# EasyEDA Pro project RC Transmitter.epro

# Schematic V1
Board Name: Transmitter; Create Date: 2025-02-19; Page Name: P1; Project Name: RC Transmitter; Schematic Name: V1; Update Date: 2025-03-01; Company: MUS; Page Size: A4; Version: V1.0
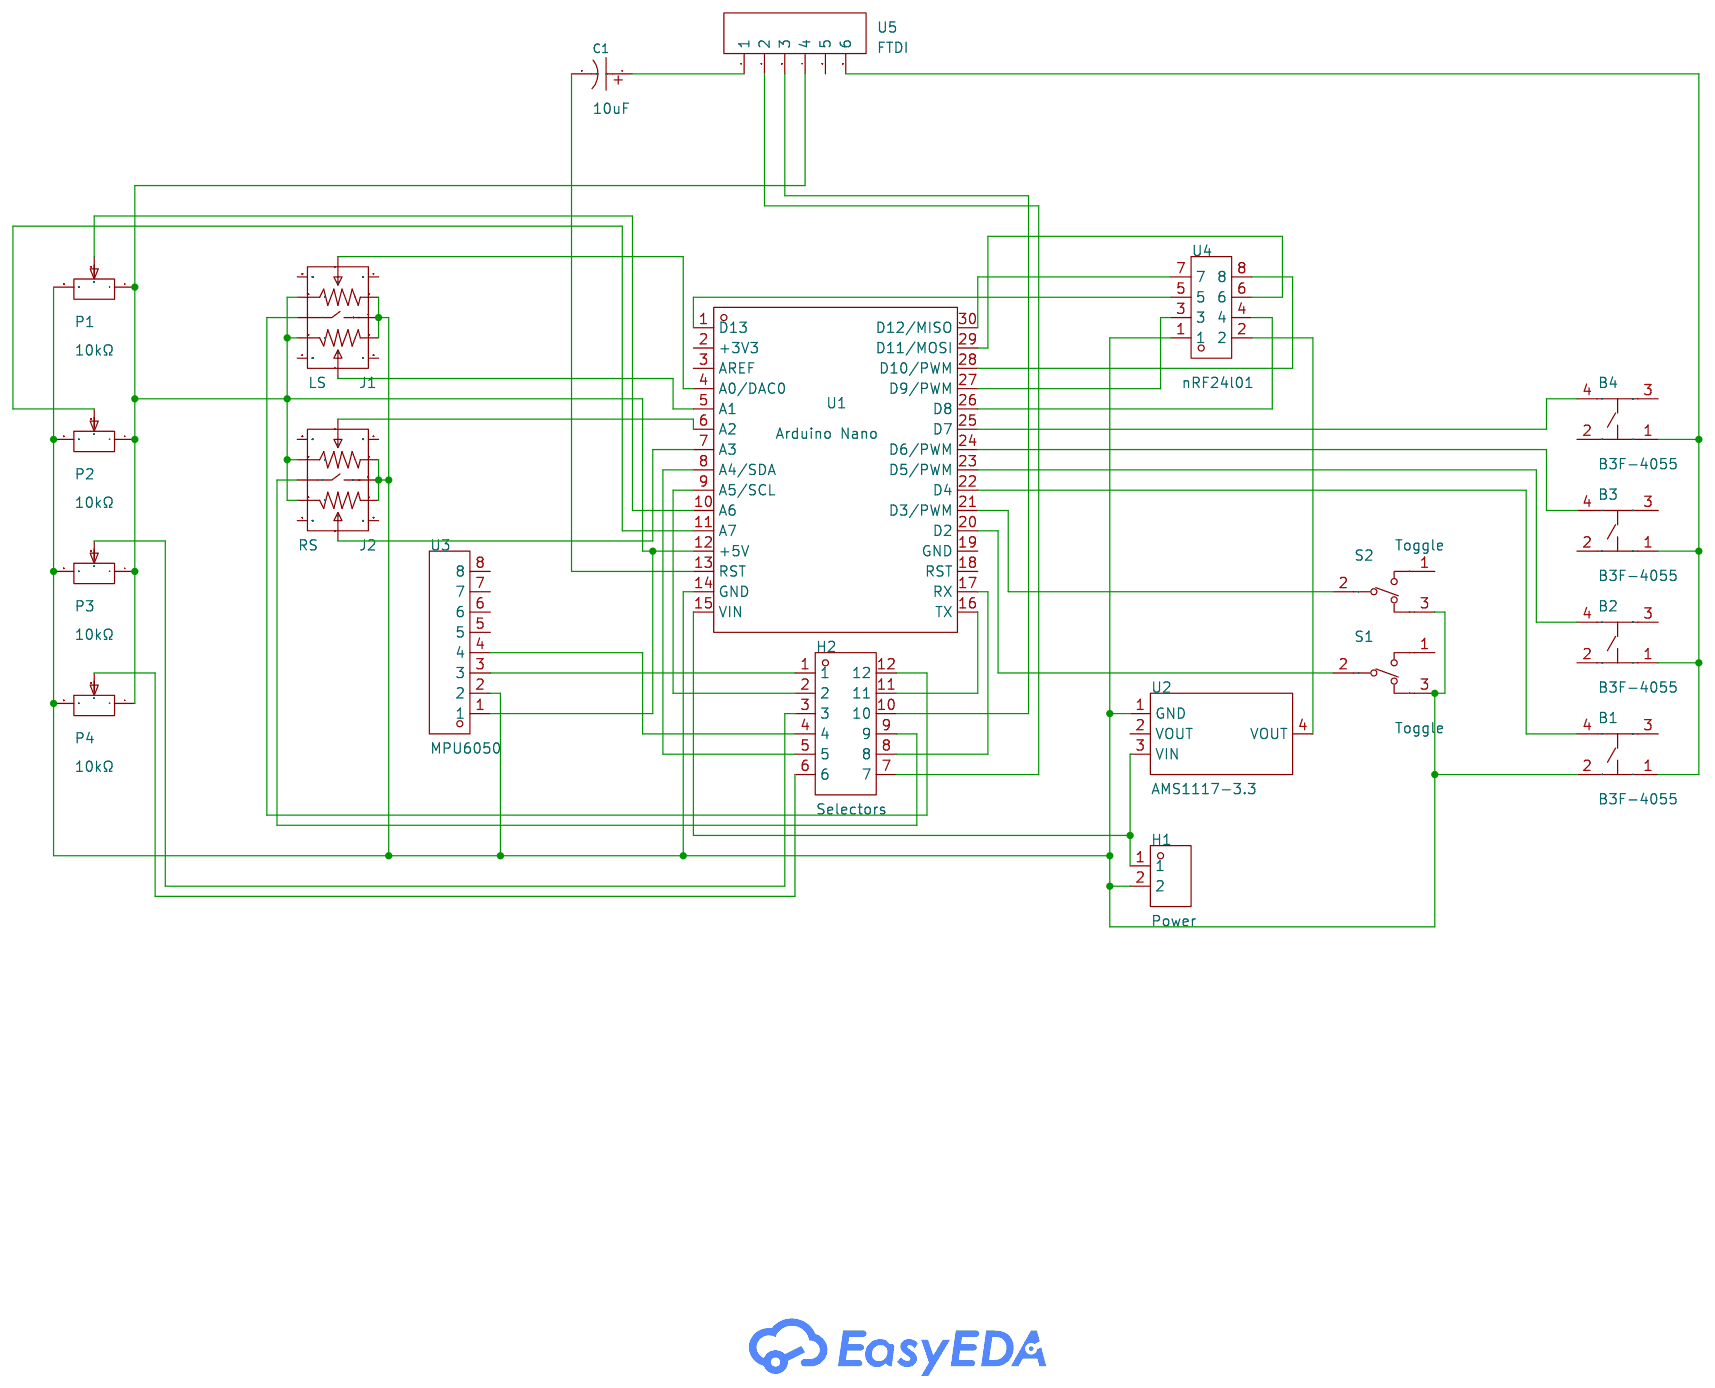
[diagram p0: schematic sheet]

## Parts
B1  B3F-4055  [KEY-TH_4P-L12.0-W12.0-P5.00-LS13.4-EH]
B2  B3F-4055  [KEY-TH_4P-L12.0-W12.0-P5.00-LS13.4-EH]
B3  B3F-4055  [KEY-TH_4P-L12.0-W12.0-P5.00-LS13.4-EH]
B4  B3F-4055  [KEY-TH_4P-L12.0-W12.0-P5.00-LS13.4-EH]
C1  10uF  [CAP-TH_BD5.0-P2.00-D0.8-FD]
H1  Power  [HDR-TH_2P-P2.54-V-M_5]
H2  Selectors  [HDR-TH_12P-P2.54-V-M-R3-C4-S2.54]
J1  LS  [JOYTICK-TH_YF16S-FL7.2-B5KB-45-10-Y_1]
J2  RS  [JOYTICK-TH_YF16S-FL7.2-B5KB-45-10-Y_1]
P1  10kΩ  [RES-ADJ-TH_RK1631110U1Q]
P2  10kΩ  [RES-ADJ-TH_RK1631110U1Q]
P3  10kΩ  [RES-ADJ-TH_RK1631110U1Q]
P4  10kΩ  [RES-ADJ-TH_RK1631110U1Q]
S1  Toggle  [SW-TH_ST-0-103-A01]
S2  Toggle  [SW-TH_ST-0-103-A01]
U1  Arduino Nano  [MOD-TH_ABX00028]
U2  AMS1117-3.3  [SOT-223-3_L6.5-W3.4-P2.30-LS7.0-BR]
U3  MPU6050  [HDR-TH_8P-P2.54-V-F]
U4  nRF24l01  [HDR-TH_8P-P2.54-V-F-R2-C4-S2.54]
U5  FTDI  [HDR-TH_6P-P2.54-V-M-1]

## Library data of the parts
B1-B4 = B3F-4055_C84931: Circuit:SPST Actuator Style:Rectangle button Mounting Style:Direct Insert Switch Length:12mm Switch Width:12mm Switch Height:7.3mm Contact Current:50mA Voltage Rating (DC):24V With Lamp:- Mechanical Life:-; LCSC Part Name: 12*12*7.3mm 直插 轻触开关; Supplier Part: C84931; Manufacturer: OMRON(欧姆龙); Supplier Footprint: 插件; JLCPCB Part Class: Extended Part; Datasheet: https://atta.szlcsc.com/upload/public/pdf/source/20170810/C93157_1502335414592880008.pdf; Supplier: LCSC; Circuit: SPST; Actuator Style: Rectangle button; Mounting Style: Direct Insert; Switch Length: 12mm; Switch Width: 12mm; Switch Height: 7.3mm; Contact Current: 50mA; Voltage Rating (DC): 24V
C1 = RD1H106M05011PC: Capacitance: Tolerance:±20% Tolerance:±20% Rated Voltage: Ripple Current:- Equivalent Series Resistance(ESR):- Lead Spacing: φD: L: Lifetime @ Temp:1000hrs@105℃; LCSC Part Name: 10uF ±20% 50V; Supplier Part: C160624; Manufacturer: SAMWHA(三和); Supplier Footprint: 插件,D5xL11mm; JLCPCB Part Class: Extended Part; Datasheet: https://atta.szlcsc.com/upload/public/pdf/source/20171212/C160624_15130639695151177990.pdf; Supplier: LCSC; Tolerance: ±20%; Lifetime @ Temp: 1000hrs@105℃
H1 = PZ254-1-02-Z-C: Pin Structure:1x2P Pitch:2.54mm Row Spacing:- Circluar Pins/Square Pins:Circular Pins Mounting Type:Straight Number of Rows:Plugin Number of Pins:2P Current Rating (Max):3A Length of Mating Pin:4.13mm Insulation Height:3mm Length of End Connection Pin:3mm; LCSC Part Name: 1x2P 间距:2.54mm 圆针 直插; Supplier Part: C5156429; Manufacturer: HCTL(华灿天禄); Supplier Footprint: 插件,P=2.54mm; JLCPCB Part Class: Extended Part; Datasheet: https://atta.szlcsc.com/upload/public/pdf/source/20230609/791AB95BE9F63E00E86E05F9E750B3EF.pdf; Supplier: LCSC; Pin Structure: 1x2P; Pitch: 2.54mm; Circluar Pins/Square Pins: Circular Pins; Mounting Type: Straight; Number of Rows: Plugin; Number of Pins: 2P; Current Rating (Max): 3A; Length of Mating Pin: 4.13mm; Insulation Height: 3mm; Length of End Connection Pin: 3mm; Contact Plating: Gold; Operating Temperature Range: -40℃~+105℃; Soldering Temperature(Max): 260℃@10S; Color: Black
H2 = HX PZ2.54-3x4P ZZ: Pin Structure:3x4P Pitch:2.54mm Row Spacing:2.54mm Circluar Pins/Square Pins:Policy Mounting Type:Direct Insert Number of Rows:Triple row Number of Pins:12P Current Rating (Max):3A Voltage Rating (Max):- Length of Mating Pin:6mm Insulation Height:2.5mm Le; LCSC Part Name: 3x4P 间距:2.54mm 方针 直插; Supplier Part: C32713291; Manufacturer: hanxia(韩下); Supplier Footprint: 插件,P=2.54mm; JLCPCB Part Class: Extended Part; Datasheet: https://atta.szlcsc.com/upload/public/pdf/source/20240723/03D5BD78F4265407C742BB8D20821E6B.pdf; Supplier: LCSC; Pin Structure: 3x4P; Pitch: 2.54mm; Row Spacing: 2.54mm; Circluar Pins/Square Pins: Policy; Mounting Type: Direct Insert; Number of Rows: Triple row; Number of Pins: 12P; Current Rating (Max): 3A; Length of Mating Pin: 6mm; Insulation Height: 2.5mm; Length of End Connection Pin: 3mm; Contact Material: Brass; Contact Plating: Gold; Operating Temperature Range: -40℃~+105℃; Color: Black
J1 J2 = YK16S-L7.2-B10Ka(32-8)-G-A29: Supplier Part: C37323746; Manufacturer: YTL(亚特联); Supplier Footprint: 插件-14P,25.5x20.3mm; JLCPCB Part Class: Extended Part; Datasheet: https://atta.szlcsc.com/upload/public/pdf/source/20240806/64164D0292DFB73772BA7D51AE6DE61A.pdf; Supplier: LCSC
P1-P4 = RK1631110U1Q: Resistance: Tolerance:±20% Tolerance:±20% Rated Voltage:5V Power(Watts):100mW Turns:-; LCSC Part Name: 10kΩ ±20%; Supplier Part: C370978; Manufacturer: ALPSALPINE(阿尔卑斯阿尔派); Supplier Footprint: 插件-3P; JLCPCB Part Class: Extended Part; Datasheet: https://atta.szlcsc.com/upload/public/pdf/source/20200316/C370978_CD3B440EA36CD020F36D6A1E0C06FB64.pdf; Supplier: LCSC; Tolerance: ±20%; Rated Voltage: 5V; Power(Watts): 100mW
S1 S2 = ST-0-103-A01-T000-RS: Circuit:Single Pole Double Throw (SPDT) Switch Length:8.3mm Switch Width:5.2mm Switch Height:23.6mm Mechanical Life:- Contact Current:3A Voltage Rating (AC):125V Actuator Type:Cylinder knob Pin Style:Solder Mounting Style:Direct Insert Operating Temperatu; LCSC Part Name: 超小型钮子三脚三档 五件套 含配件; Supplier Part: C1788488; Manufacturer: YUEN FUNG(源丰); Supplier Footprint: 插件; JLCPCB Part Class: Extended Part; Datasheet: https://atta.szlcsc.com/upload/public/pdf/source/20230720/34A1F41796E6F2C5E358D19C4AAA567D.pdf; Supplier: LCSC; Circuit: Single Pole Double Throw (SPDT); Switch Length: 8.3mm; Switch Width: 5.2mm; Switch Height: 23.6mm; Contact Current: 3A; Voltage Rating (AC): 125V; Actuator Type: Cylinder knob; Pin Style: Solder; Mounting Style: Direct Insert; Operating Temperature: -25℃~+85℃
U1 = ABX00028: Supplier Part: C21303176; Manufacturer: arduino; Datasheet: https://atta.szlcsc.com/upload/public/pdf/source/20240516/DBE20BC6A27351D8B1B352A6E0678D57.pdf; Supplier: LCSC
U2 = AMS1117-3.3_C6186: Output Type:Fixed Voltage - Supply:- Output Voltage:3.3V Output Voltage:3.3V Output Current:1A Power Supply Rejection Ratio (PSRR):72dB@(120Hz) Voltage Dropout:1.3V@(800mA) standby current:- Noise:- Features:Overcurrent Protection(OCP)；Thermal Protection(; LCSC Part Name: 输出3.3V 1A; Supplier Part: C6186; Manufacturer: AMS; Supplier Footprint: SOT-223; JLCPCB Part Class: Basic Part; Datasheet: https://atta.szlcsc.com/upload/public/pdf/source/20180727/C6186_7A095716F0823C02F1997A905E26C086.pdf; Supplier: LCSC; Output Type: Fixed; Output Voltage: 3.3V; Output Current: 1A; Power Supply Rejection Ratio (PSRR): 72dB@(120Hz); Voltage Dropout: 1.3V@(800mA); Features: Overcurrent Protection(OCP)；Thermal Protection(TSD); Output Configuration: Positive electrode; Number of Outputs: 1
U3 = KH-2.54FH-1X8P-H8.5: Holes Structure:1x8P Pitch:2.54mm Row Spacing:- Circular Hole / Square Hole:Square Holes Mounting Type:Straight Number of Rows:Plugin Number of Holes:8P Current Rating (Max):3A Voltage Rating (Max):- Holes Direction:Top Insulation Height:8.5mm Operating T; LCSC Part Name: 间距:2.54mm 1x8P 直插; Supplier Part: C2905417; Manufacturer: kinghelm(金航标); Supplier Footprint: 插件,P=2.54mm; JLCPCB Part Class: Extended Part; Datasheet: https://atta.szlcsc.com/upload/public/pdf/source/20211019/4EE60A4A588681C04A5AE3F1D2563204.pdf; Supplier: LCSC; Holes Structure: 1x8P; Pitch: 2.54mm; Circular Hole / Square Hole: Square Holes; Mounting Type: Straight; Number of Rows: Plugin; Number of Holes: 8P; Current Rating (Max): 3A; Holes Direction: Top; Insulation Height: 8.5mm; Operating Temperature Range: -40℃~+105℃
U4 = 2.54-2*4: Holes Structure:2x4P Pitch:2.54mm Row Spacing:2.54mm Circular Hole / Square Hole:Square Holes Mounting Type:Straight Number of Rows:双排 Number of Holes:8P Current Rating (Max):2.5A Voltage Rating (Max):- Holes Direction:Top Insulation Height:8.5mm Operatin; LCSC Part Name: 间距:2.54mm 2x4P 直插; Supplier Part: C2977588; Manufacturer: ZHOURI(洲日); Supplier Footprint: 插件,P=2.54mm; JLCPCB Part Class: Extended Part; Datasheet: https://atta.szlcsc.com/upload/public/pdf/source/20220328/363EB391BC0EB759CF231FC910753CBE.pdf; Supplier: LCSC; Holes Structure: 2x4P; Pitch: 2.54mm; Row Spacing: 2.54mm; Circular Hole / Square Hole: Square Holes; Mounting Type: Straight; Number of Rows: 双排; Number of Holes: 8P; Current Rating (Max): 2.5A; Holes Direction: Top; Insulation Height: 8.5mm; Operating Temperature Range: -40℃~+105℃
U5 = 2.54-1x6P直针: Pin Structure:1x6P Pitch:2.54mm Row Spacing:- Circluar Pins/Square Pins:Square Pins Mounting Type:Straight Number of Rows:Plugin Number of Pins:6P Current Rating (Max):3A Voltage Rating (Max):- Length of Mating Pin:- Insulation Height:- Contact Material:; LCSC Part Name: 间距:2.54mm 1x6P 直插 方针; Supplier Part: C37208; Manufacturer: BOOMELE(博穆精密); Supplier Footprint: 插件,P=2.54mm; JLCPCB Part Class: Extended Part; Supplier: LCSC; Pin Structure: 1x6P; Pitch: 2.54mm; Circluar Pins/Square Pins: Square Pins; Mounting Type: Straight; Number of Rows: Plugin; Number of Pins: 6P; Current Rating (Max): 3A; Operating Temperature Range: -40℃~+105℃; Color: Black

## Nets
$1N1147: H1.1 U1.15(VIN) U2.3(VIN)
$1N1199: U2.4(VOUT) U4.2
$1N1205: U1.26(D8) U4.4
$1N1524: H2.11 U1.16(TX)
$1N1529: H2.8 U1.17(RX)
$1N1536: H2.2 U1.9(A5/SCL)
$1N1543: H2.5 U1.8(A4/SDA)
$1N1578: H2.1 U3.3
$1N1583: H2.4 U3.4
$1N2005: J1.3 J1.6 J2.3 J2.6 P1.1 P2.1 P3.1 P4.1 U1.12(+5V) U3.1 U5.4
$1N2037: J1.2 U1.4(A0/DAC0)
$1N2043: J1.5 U1.5(A1)
$1N2050: J2.2 U1.6(A2)
$1N2056: J2.5 U1.7(A3)
$1N2070: H2.9 J2.7
$1N2078: H2.12 J1.7
$1N2449: S1.2 U1.20(D2)
$1N2457: S2.2 U1.21(D3/PWM)
$1N2530: B1.2 H1.2 J1.1 J1.4 J1.8 J2.1 J2.4 J2.8 P1.3 P2.3 P3.3 P4.3 S1.3 S2.3 U1.14(GND) U2.1(GND) U3.2 U4.1
$1N3701: P1.2 U1.10(A6)
$1N3709: P2.2 U1.11(A7)
$1N3721: H2.6 P4.2
$1N3728: H2.3 P3.2
$1N3737: B1.1 B2.1 B3.1 B4.1 U5.6
$1N3876: U1.1(D13) U4.5
$1N3899: U1.27(D9/PWM) U4.3
$1N3905: U1.30(D12/MISO) U4.7
$1N3910: U1.29(D11/MOSI) U4.6
$1N3918: U1.28(D10/PWM) U4.8
$1N3925: B4.4 U1.25(D7)
$1N3931: B3.4 U1.24(D6/PWM)
$1N3938: B2.4 U1.23(D5/PWM)
$1N3945: B1.4 U1.22(D4)
$1N4184: C1.1 U5.1
$1N4188: C1.2 U1.13(RST)
$1N4194: H2.10 U5.3
$1N4204: H2.7 U5.2

Not connected (* = marked no-connect by the designer): B1 3; B2 2 3; B3 2 3; B4 2 3; J1 9(shell) 10(shell) 11(shell) 12(shell); J2 9(shell) 10(shell) 11(shell) 12(shell); S1 1; S2 1; U1 2(+3V3) 3(AREF) 18(RST) 19(GND); U2 2(VOUT); U3 5 6 7 8; U5 5

# Board PCB
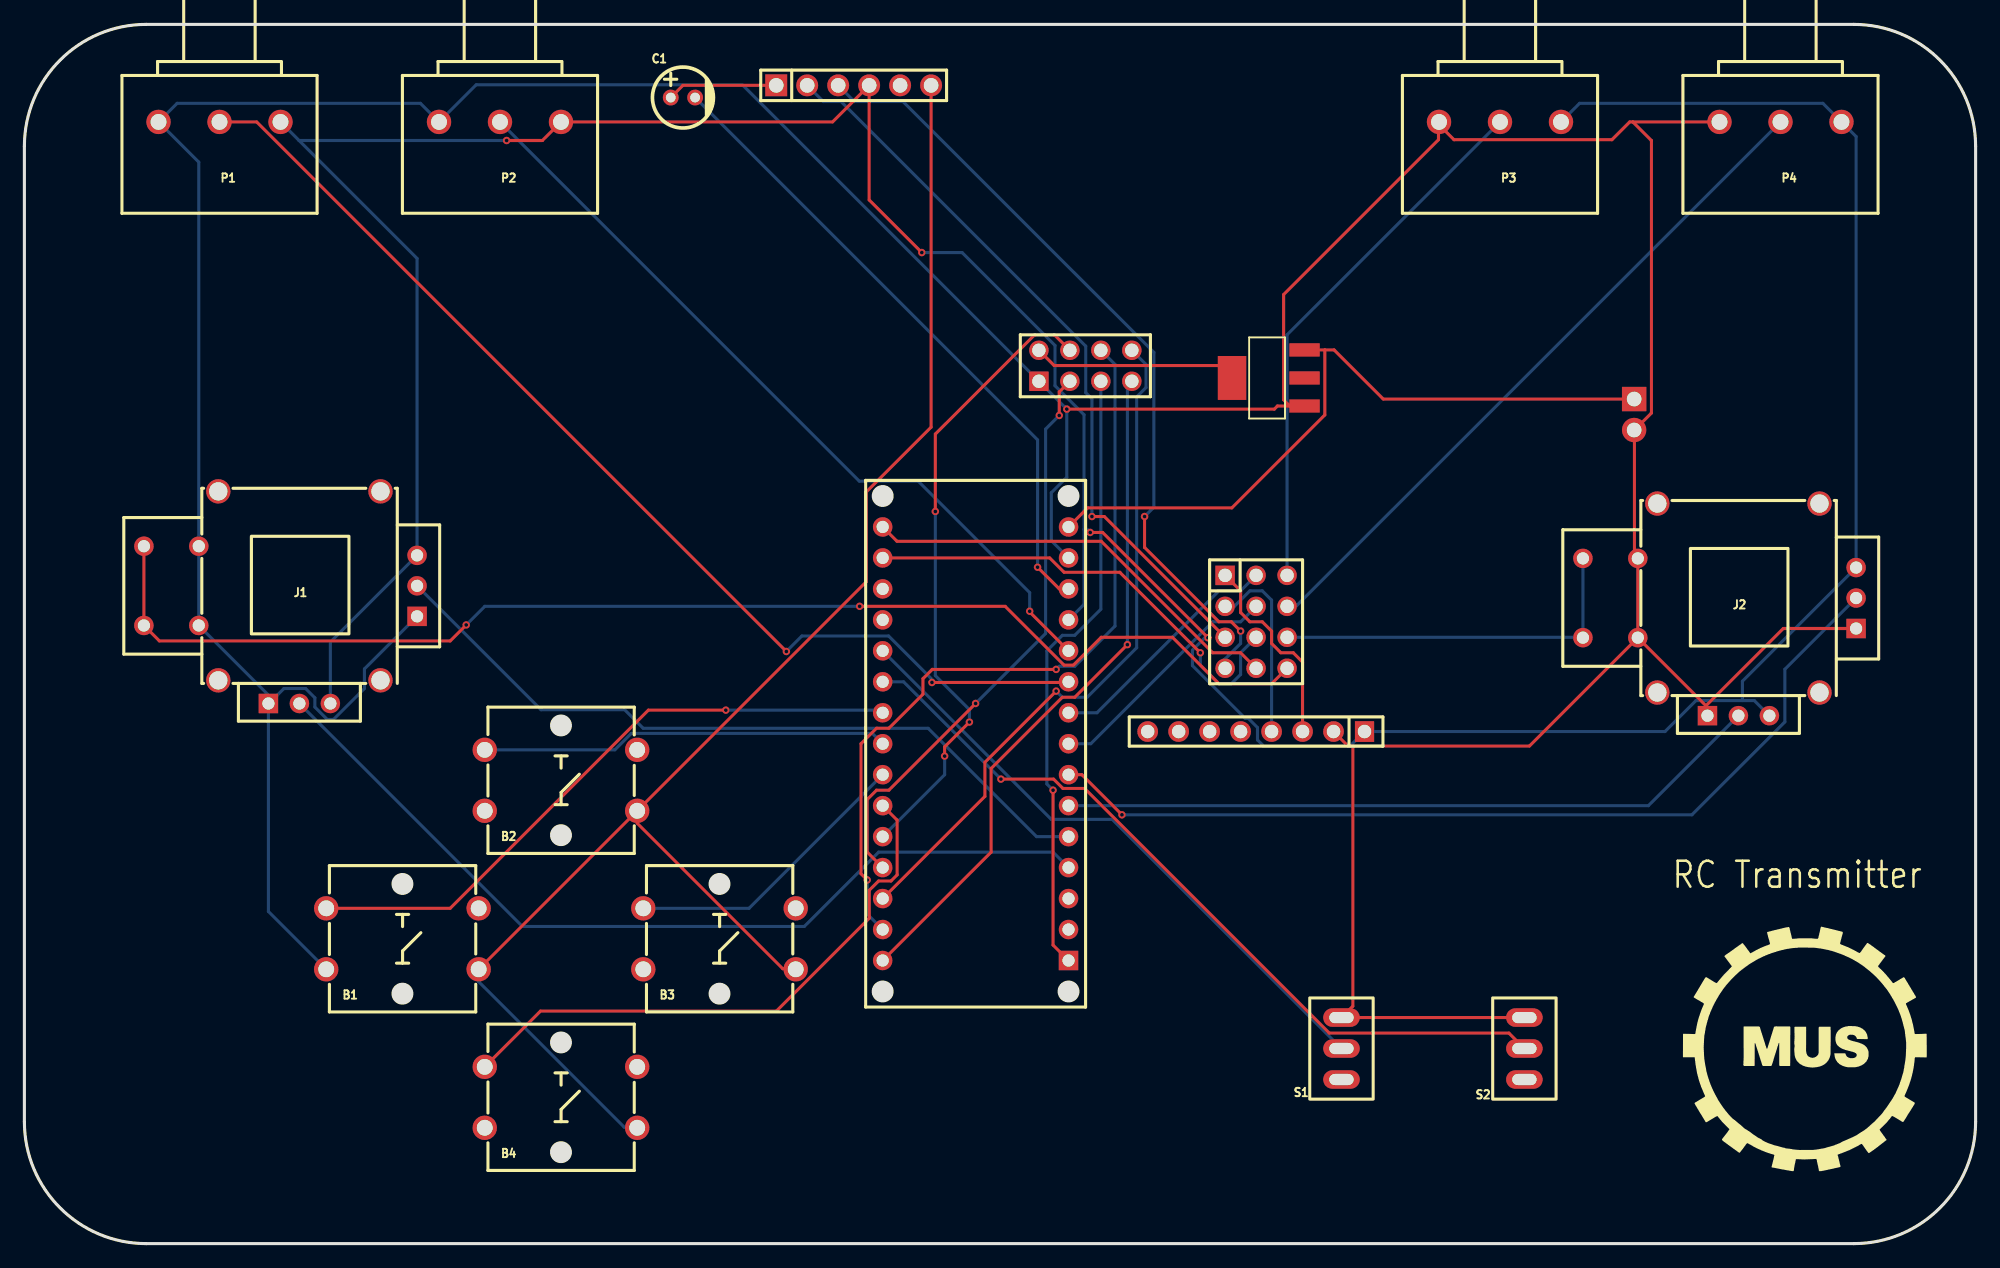
[diagram p1: board, top side]
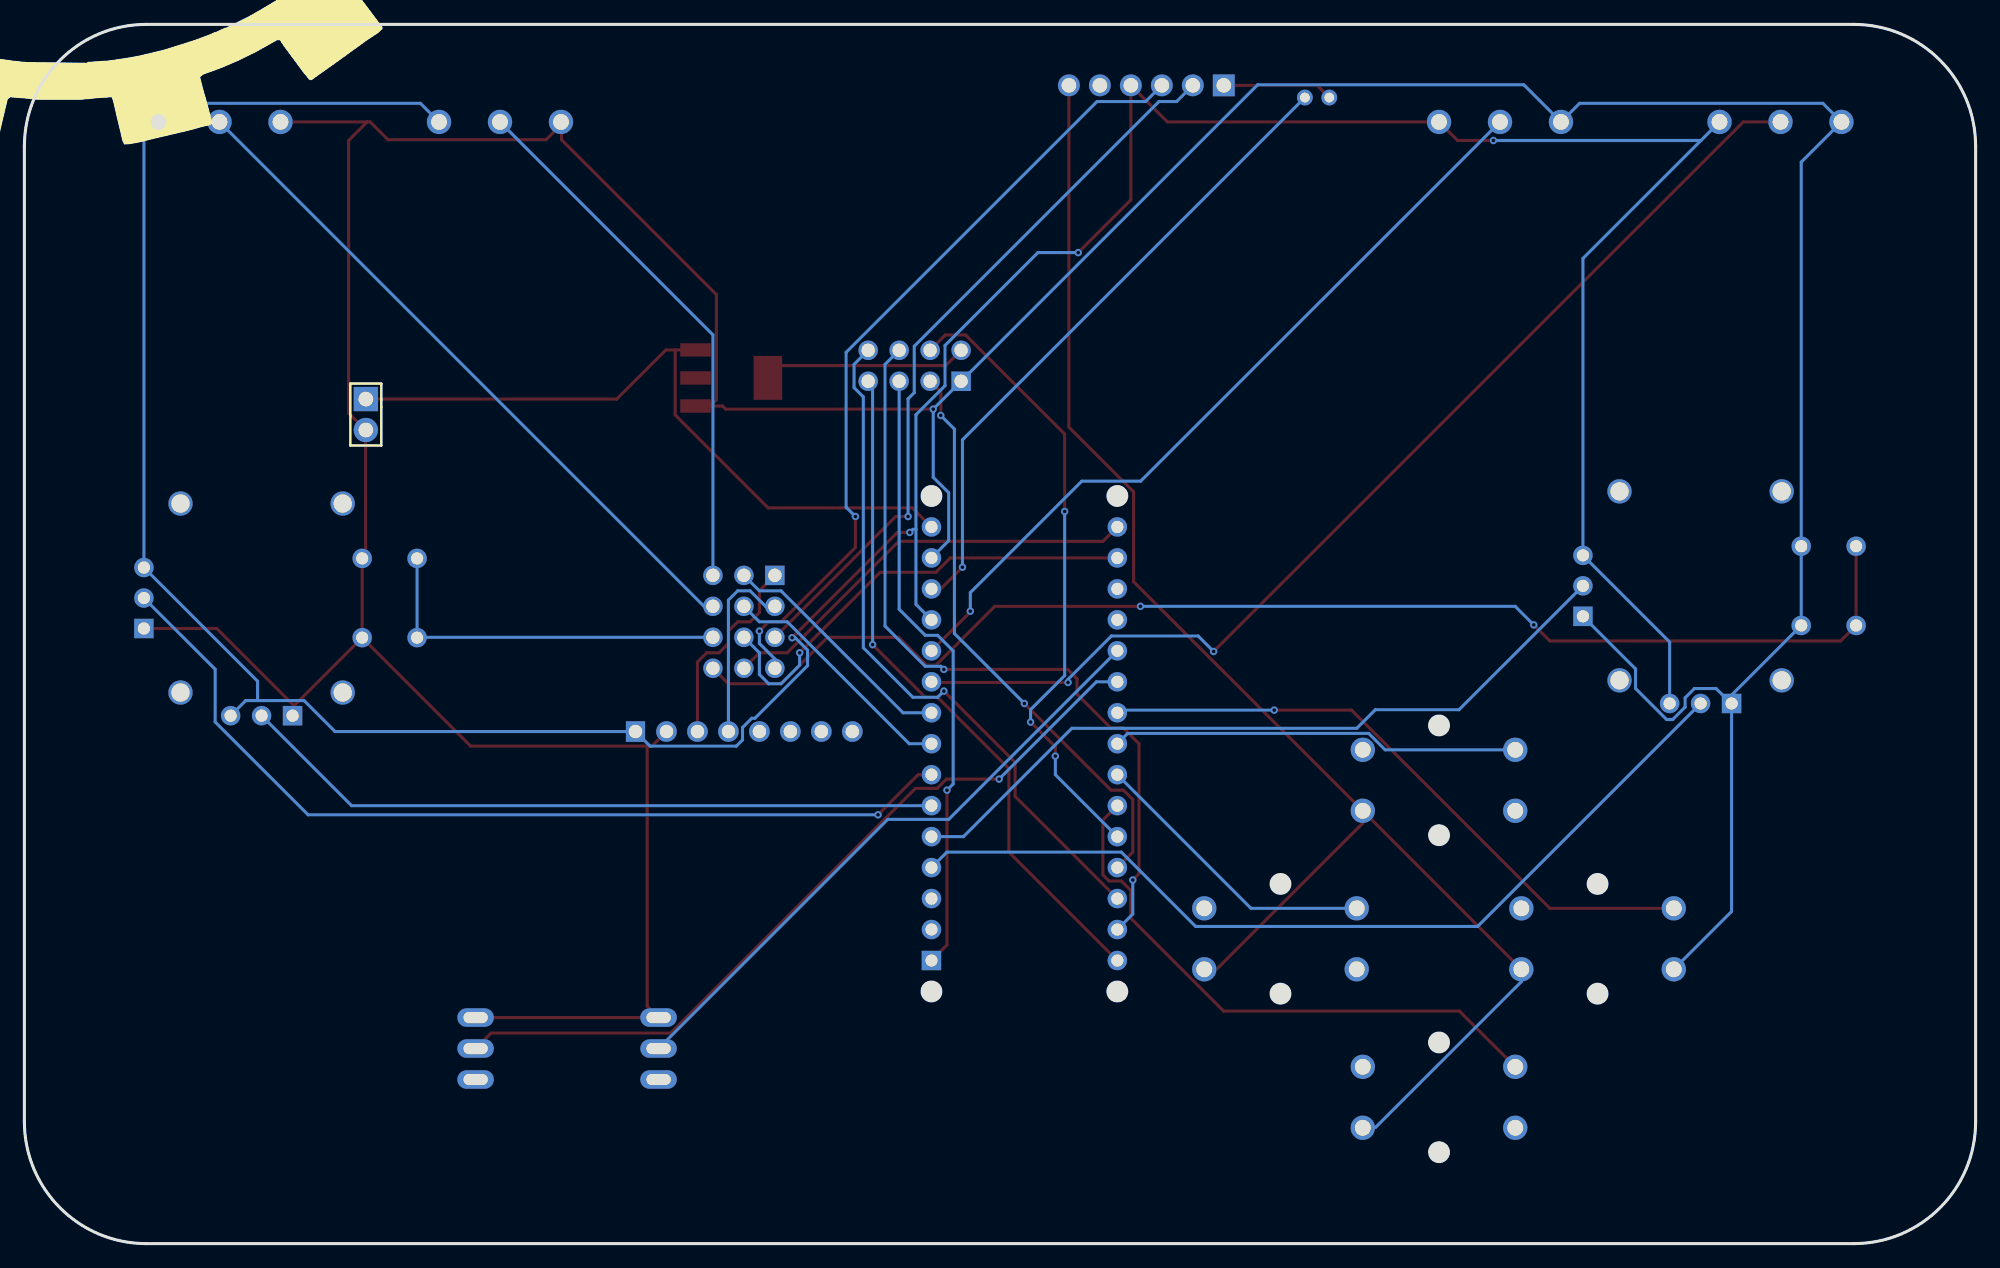
[diagram p2: board, bottom side, seen from below]

Outline 160 x 100 mm; copper layers: Top Layer, Bottom Layer. Coordinates in mm from the lower left corner of the outline.
Outline path: 0,90 0,10 arc(2.93,2.93) 10,0 150,0 arc(157.07,2.93) 160,10 160,90 arc(157.07,97.07) 150,100 10,100 arc(2.93,97.07) 0,90
Stack: Top Layer 0.035mm / Dielectric1 1.51mm FR4 er 4.5 / Bottom Layer 0.035mm

## Design rules (mm)
template: JLCPCB Capability(Two Layers Board)
spacing copperThickness1oz (default): track to track 0.102, other pairs 0.152 to 0.3
spacing copperThickness2oz: track to track 0.203, other pairs 0.152 to 0.3
track width copperThickness1oz (default): min 0.127, default 0.254, max 2.54
track width copperThickness2oz: min 0.203, default 0.254, max 2.54
differential pair differentialPair (default): width min 0.127, default 0.254, max 2.54; gap min 0.152, default 0.152
via viaSize (default): diameter min 0.5, default 0.61, max 10; hole min 0.3, default 0.305, max 6.3

## Placement (name value [footprint] x y rotation side)
B1  B3F-4055  [KEY-TH_4P-L12.0-W12.0-P5.00-LS13.4-EH]  31 25 0 top
B2  B3F-4055  [KEY-TH_4P-L12.0-W12.0-P5.00-LS13.4-EH]  44 38 0 top
B3  B3F-4055  [KEY-TH_4P-L12.0-W12.0-P5.00-LS13.4-EH]  57 25 0 top
B4  B3F-4055  [KEY-TH_4P-L12.0-W12.0-P5.00-LS13.4-EH]  44 12 0 top
C1  10uF  [CAP-TH_BD5.0-P2.00-D0.8-FD]  54 94 0 top
H1  Power  [HDR-TH_2P-P2.54-V-M_5]  132 68 270 bottom
H2  Selectors  [HDR-TH_12P-P2.54-V-M-R3-C4-S2.54]  101 51 270 top
J1  LS  [JOYTICK-TH_YF16S-FL7.2-B5KB-45-10-Y_1]  21 53 0 top
J2  RS  [JOYTICK-TH_YF16S-FL7.2-B5KB-45-10-Y_1]  139 52 0 top
P1  10kΩ  [RES-ADJ-TH_RK1631110U1Q]  16 92 90 top
P2  10kΩ  [RES-ADJ-TH_RK1631110U1Q]  39 92 90 top
P3  10kΩ  [RES-ADJ-TH_RK1631110U1Q]  121 92 90 top
P4  10kΩ  [RES-ADJ-TH_RK1631110U1Q]  144 92 90 top
S1  Toggle  [SW-TH_ST-0-103-A01]  108 16 90 top
S2  Toggle  [SW-TH_ST-0-103-A01]  123 16 90 top
U1  Arduino Nano  [MOD-TH_ABX00028]  78 41 180 top
U2  AMS1117-3.3  [SOT-223-3_L6.5-W3.4-P2.30-LS7.0-BR]  102 71 0 top
U3  MPU6050  [HDR-TH_8P-P2.54-V-F]  101 42 180 top
U4  nRF24l01  [HDR-TH_8P-P2.54-V-F-R2-C4-S2.54]  87 72 0 top
U5  FTDI  [HDR-TH_6P-P2.54-V-M-1]  68 95 0 top

## Footprints (pads in the part's own frame, mm; a bottom-side part is the same pattern mirrored in y, then rotated)
CAP-TH_BD5.0-P2.00-D0.8-FD
  round 1.3 hole 0.8: 1(-1,0) 2(1,0)
HDR-TH_2P-P2.54-V-M_5
  rect 2x2 hole 1.2: 1(-1.27,0)
  round 2 hole 1.2: 2(1.27,0)
HDR-TH_6P-P2.54-V-M-1
  rect 1.8x1.8 hole 1.2: 1(-6.35,0)
  round 1.8 hole 1.2: 2(-3.81,0) 3(-1.27,0) 4(1.27,0) 5(3.81,0) 6(6.35,0)
HDR-TH_8P-P2.54-V-F
  rect 1.575x1.7 hole 1.1: 1(-8.89,0)
  round 1.7 hole 1.1: 2(-6.35,0) 3(-3.81,0) 4(-1.27,0) 5(1.27,0) 6(3.81,0) 7(6.35,0) 8(8.89,0)
HDR-TH_8P-P2.54-V-F-R2-C4-S2.54
  rect 1.6x1.6 hole 1.1: 1(-3.81,-1.27)
  round 1.6 hole 1.1: 2(-3.81,1.27) 3(-1.27,-1.27) 4(-1.27,1.27) 5(1.27,-1.27) 6(1.27,1.27) 7(3.81,-1.27) 8(3.81,1.27)
HDR-TH_12P-P2.54-V-M-R3-C4-S2.54
  rect 1.6x1.6 hole 1.1: 1(-3.81,-2.54)
  round 1.6 hole 1.1: 2(-3.81,0) 3(-3.81,2.54) 4(-1.27,-2.54) 5(-1.27,0) 6(-1.27,2.54) 7(1.27,-2.54) 8(1.27,0) 9(1.27,2.54) 10(3.81,-2.54) 11(3.81,0) 12(3.81,2.54)
JOYTICK-TH_YF16S-FL7.2-B5KB-45-10-Y_1
  rect 1.6x1.6 hole 1: 1(-0.99,-8.7) 4(11.2,-1.55)
  round 1.6 hole 1: 2(1.55,-8.7) 3(4.09,-8.7) 5(11.2,0.95) 6(11.2,3.45) 7(-11.2,4.2) 7(-11.2,-2.3) 8(-6.7,4.2) 8(-6.7,-2.3)
  round 2 hole 1.5: 9(-5.1,8.7) 10(8.2,8.7) 11(8.2,-6.8) 12(-5.1,-6.8)
KEY-TH_4P-L12.0-W12.0-P5.00-LS13.4-EH
  round 2 hole 1.3: 1(6.25,-2.5) 2(-6.25,-2.5) 3(6.25,2.5) 4(-6.25,2.5)
MOD-TH_ABX00028
  rect 1.6x1.6 hole 1: 1(-7.62,17.78)
  round 1.6 hole 1: 2(-7.62,15.24) 3(-7.62,12.7) 4(-7.62,10.16) 5(-7.62,7.62) 6(-7.62,5.08) 7(-7.62,2.54) 8(-7.62,0) 9(-7.62,-2.54) 10(-7.62,-5.08) 11(-7.62,-7.62) 12(-7.62,-10.16) 13(-7.62,-12.7) 14(-7.62,-15.24) 15(-7.62,-17.78) 16(7.62,-17.78) 17(7.62,-15.24) 18(7.62,-12.7) 19(7.62,-10.16) 20(7.62,-7.62) 21(7.62,-5.08) 22(7.62,-2.54) 23(7.62,0) 24(7.62,2.54) 25(7.62,5.08) 26(7.62,7.62) 27(7.62,10.16) 28(7.62,12.7) 29(7.62,15.24) 30(7.62,17.78)
RES-ADJ-TH_RK1631110U1Q
  round 2 hole 1.3: 1(0,-5) 2(0,0) 3(0,5)
SOT-223-3_L6.5-W3.4-P2.30-LS7.0-BR
  rect 2.5x1.1 smd: 1(2.97,-2.3) 2(2.97,0) 3(2.97,2.3)
  rect 2.34x3.6 smd: 4(-2.97,0)
SW-TH_ST-0-103-A01
  oval 1.524x3 hole 0.914x2: 1(-2.54,0) 2(0,0) 3(2.54,0)

## Nets
As in the schematic.

Pads without a net: B1 3; B2 2 3; B3 2 3; B4 2 3; J1 9 10 11 12; J2 9 10 11 12; S1 1; S2 1; U1 2 3 18 19; U2 2; U3 5 6 7 8; U5 5

## Via types
v1: diameter 0.61, hole 0.305, Top Layer to Bottom Layer, 28 vias

## Routing (per net, layer and track width the routed paths; a pad name or vN(x,y) marks a point on that pad's centre or on a via; arc(x,y) is an arc through that point)
$1N1147: length 58.9
  Top Layer w0.254: 106.63,73.3 106.63,67.97 99.01,60.35 87.19,60.35 U1.15 ; 106.63,73.3 U2.3 ; 106.63,73.3 107.4,73.3 111.43,69.27 H1.1
$1N1199: length 16.8
  Top Layer w0.254: U4.2 84.44,72.02 98.01,72.02 U2.4
$1N1205: length 52
  Top Layer w0.254: v1(77.49,42.78) 75.46,40.75 v1(75.46,39.98) ; v1(74.7,60.05) 74.7,66.4 82.83,74.53 84.47,74.53 U4.4
  Bottom Layer w0.254: v1(74.7,60.05) 74.7,46.59 77.49,43.79 v1(77.49,42.78) ; U1.26 75.46,38.46 v1(75.46,39.98)
$1N1524: length 35.4
  Top Layer w0.254: U1.16 71.56,57.6 88.3,57.6 97.44,48.46 99.73,48.46 H2.11
$1N1529: length 38.1
  Top Layer w0.254: v1(96.43,48.46) 89.82,55.06 85.25,55.06 84.08,56.24 U1.17
  Bottom Layer w0.254: v1(96.43,48.46) 96.43,47.44 97.95,45.92 98.97,45.92 99.73,46.68 99.73,48.46 H2.8
$1N1536: length 20
  Bottom Layer w0.254: H2.2 99.73,53.54 97.95,53.54 87.95,43.54 U1.9
$1N1543: length 20
  Bottom Layer w0.254: U1.8 87.44,41 97.44,51 99.73,51 H2.5
$1N1578: length 16.6
  Top Layer w0.254: U3.3 104.81,47.7 104.05,48.46 103.03,48.46 102.27,49.22 102.27,50.24 101.51,51 100.49,51 99.73,51.76 99.73,53.54 H2.1
$1N1583: length 15.4
  Bottom Layer w0.254: U3.4 102.27,52.78 101.51,53.54 100.49,53.54 99.22,52.27 H2.4
$1N2005: length 303.1
  Top Layer w0.254: v1(39.54,90.48) 42.48,90.48 P2.1 66.27,92 U5.4 69.27,85.6 v1(73.59,81.28) ; v1(97.05,49.69) 88.41,58.33 v1(87.4,58.33)
  Bottom Layer w0.254: 140.88,44.54 141.85,44.54 J2.3 ; 140.88,44.54 140.88,46.13 J2.6 150.2,90.8 P4.1 147.48,93.52 127.52,93.52 P3.1 ; 140.88,44.54 137.07,44.54 134.53,42 U3.1 108.69,40.8 101.62,40.8 101.11,41.31 101.11,42.33 100.35,43.09 100.1,43.09 95.78,47.41 95.78,48.68 96.8,49.69 v1(97.05,49.69) ; 22.52,90.48 P1.1 ; 22.52,90.48 v1(39.54,90.48) ; 22.52,90.48 32.2,80.8 J1.6 25.09,49.34 J1.3 ; 86.89,58.58 87.14,58.58 v1(87.4,58.33) ; 86.89,58.58 86.89,52.43 U1.12 ; 86.89,58.58 86.89,67.98 84.51,70.36 84.51,73.66 76.89,81.28 v1(73.59,81.28)
$1N2037: length 73.7
  Bottom Layer w0.254: J1.2 40.84,26.01 63.95,26.01 70.05,32.11 84.35,32.11 U1.4
$1N2043: length 61.9
  Bottom Layer w0.254: U1.5 83,33.38 74.11,42.27 50.74,42.27 49.22,43.79 42.36,43.79 J1.5
$1N2050: length 58
  Bottom Layer w0.254: J2.2 133.17,35.92 U1.6
$1N2056: length 75.8
  Top Layer w0.254: v1(90,35.17) 86.71,38.46 U1.7
  Bottom Layer w0.254: v1(90,35.17) 136.74,35.17 144.36,42.79 144.36,47.11 J2.5
$1N2070: length 30.8
  Bottom Layer w0.254: H2.9 127.77,49.73 J2.7 J2.7
$1N2078: length 107
  Top Layer w0.254: v1(36.23,50.75) 34.91,49.43 11.07,49.43 J1.7 J1.7 ; v1(68.49,52.27) 80.43,52.27 85.25,47.44 86.01,47.44 88.3,49.73 94.14,49.73 97.95,45.92 102.27,45.92 H2.12
  Bottom Layer w0.254: v1(68.49,52.27) 37.75,52.27 v1(36.23,50.75)
$1N2449: length 51.1
  Bottom Layer w0.254: S1.2 89.2,34.8 84.2,34.8 U1.20
$1N2457: length 65.1
  Top Layer w0.254: v1(80.07,38.1) 84.39,38.1 85.15,37.34 86.93,37.34 107,17.27 121.73,17.27 S2.2
  Bottom Layer w0.254: U1.21 72.09,46.08 v1(80.07,38.1)
$1N2530: length 401.9
  Top Layer w0.254: 103.76,68.7 103.26,69.21 103.26,77.84 115.96,90.54 115.96,91.81 ; 103.76,68.7 102.75,68.7 102.49,68.44 v1(85.48,68.44) ; 103.76,68.7 104.97,68.7 ; J2.1 137.89,43.42 137.89,44.11 ; 108.93,40.81 123.41,40.81 J2.8 ; 108.93,40.81 108.93,19.47 S1.3 S2.3 ; 108.93,40.81 108.54,40.81 U3.2 ; 132.02,66.73 132.02,56.48 J2.8 J2.8 ; 132.02,66.73 H1.2 ; 132.02,66.73 133.42,68.12 133.42,90.48 131.89,92 ; J2.4 144.23,50.45 137.89,44.11 ; J2.8 137.89,44.11 ; 131.89,92 P4.3 ; 131.89,92 131.64,92 130.18,90.54 117.23,90.54 115.96,91.81 ; 115.96,91.81 P3.3
  Bottom Layer w0.254: B1.2 20.01,27.24 20.01,44.26 ; U1.14 84.21,57.65 84.21,61.59 85.48,62.86 v1(85.48,68.44) U4.1 58.87,95.05 37.05,95.05 P2.3 32.48,93.52 12.52,93.52 P1.3 14.3,88.7 J1.8 J1.8 20.01,44.99 J1.1 20.01,44.26 ; 20.01,44.26 21.28,45.53 23.06,45.53 23.82,44.77 23.82,44 24.84,42.99 25.34,42.99 27.88,45.53 27.88,47.13 J1.4
$1N3701: length 89.9
  Top Layer w0.254: U1.10 85.57,46.03 v1(74.42,46.03) ; P1.2 19.05,92 v1(62.48,48.57)
  Bottom Layer w0.254: v1(62.48,48.57) 63.75,49.84 70.86,49.84 74.42,46.28 v1(74.42,46.03)
$1N3709: length 65.5
  Top Layer w0.254: U1.11 82.43,51.81 v1(82.43,51.87)
  Bottom Layer w0.254: v1(82.43,51.87) 82.43,53.39 73.29,62.54 68.46,62.54 P2.2
$1N3721: length 56.9
  Bottom Layer w0.254: P4.2 104.27,52.27 H2.6
$1N3728: length 44.4
  Bottom Layer w0.254: P3.2 103.54,74.54 H2.3
$1N3737: length 125.8
  Top Layer w0.254: B3.1 63.2,22.55 62.19,22.55 50.25,34.48 B2.1 ; B2.1 69.05,54.3 69.05,61.66 74.35,66.97 U5.6 ; B2.1 B1.1
  Bottom Layer w0.254: B4.1 50.2,9.55 49.19,9.55 37.25,21.48 B1.1
$1N3876: length 50.7
  Top Layer w0.254: v1(84.35,37.19) 84.35,24.49 U1.1
  Bottom Layer w0.254: v1(84.35,37.19) 83.84,37.7 83.84,48.62 85.11,49.89 86.13,49.89 88.27,52.03 U4.5
$1N3899: length 47.9
  Top Layer w0.254: v1(84.86,67.92) 84.86,69.86 U4.3 ; U1.27 69.11,32.11 69.11,36.43 69.87,37.19 70.89,37.19 v1(78,44.3)
  Bottom Layer w0.254: v1(84.86,67.92) 83.74,66.81 83.74,50.04 v1(78,44.3)
$1N3905: length 56.6
  Top Layer w0.254: U1.30 79.27,32.11 79.27,38.97 85.11,44.81 86.13,44.81 v1(90.45,49.13)
  Bottom Layer w0.254: U4.7 90.45,70.37 v1(90.45,49.13)
$1N3910: length 64.6
  Top Layer w0.254: v1(84.6,47.1) 74.44,47.1 73.68,46.33 73.68,45.06 70.89,42.27 69.87,42.27 68.6,41 68.6,30.33 v1(69.11,29.82)
  Bottom Layer w0.254: v1(84.6,47.1) 84.86,47.35 86.13,47.35 89.43,50.65 89.43,72.11 U4.6 ; U1.29 69.11,27.03 v1(69.11,29.82)
$1N3918: length 56.6
  Top Layer w0.254: v1(84.6,45.32) 78.76,39.48 78.76,36.68 U1.28
  Bottom Layer w0.254: v1(84.6,45.32) 85.11,44.81 87.14,44.81 91.21,48.87 91.21,69.45 91.97,70.21 91.97,72.11 U4.8
$1N3925: length 47.8
  Top Layer w0.254: B4.4 42.32,19.07 61.66,19.07 69.28,26.69 69.28,28.98 70.04,29.74 71.06,29.74 71.57,30.25 71.57,34.73 U1.25
$1N3931: length 24.2
  Bottom Layer w0.254: B3.4 59.42,27.5 U1.24
$1N3938: length 33.5
  Bottom Layer w0.254: B2.4 48.42,40.5 49.76,41.85 69.53,41.85 U1.23
$1N3945: length 52.5
  Top Layer w0.254: v1(57.52,43.76) 51.17,43.76 34.91,27.5 B1.4
  Bottom Layer w0.254: U1.22 70.16,43.76 v1(57.52,43.76)
$1N4184: length 9.1
  Top Layer w0.254: C1.1 54,95 U5.1
$1N4188: length 53.4
  Top Layer w0.254: U1.13 84.86,53.7 v1(83.08,55.48)
  Bottom Layer w0.254: v1(83.08,55.48) 83.08,65.92 C1.2
$1N4194: length 65.6
  Top Layer w0.254: v1(91.86,59.64) 91.86,57.1 97.95,51 98.97,51 v1(99.73,50.24)
  Bottom Layer w0.254: v1(91.86,59.64) 92.62,60.4 92.62,73.1 72.04,93.67 68.06,93.67 U5.3 ; H2.10 98.46,47.95 99.73,49.22 v1(99.73,50.24)
$1N4204: length 60.9
  Top Layer w0.254: v1(87.54,59.64) 88.55,59.64 H2.7
  Bottom Layer w0.254: U5.2 65.52,93.67 66.96,93.67 87.03,73.61 87.03,69.8 87.54,69.29 v1(87.54,59.64)

## Text on the board
Top Silkscreen Layer: RC Transmitter
